# Altium schematic sheet SensWear_PPG.SchDoc
size A4; Size: A4; SheetNumber: 1; SheetTotal: 1
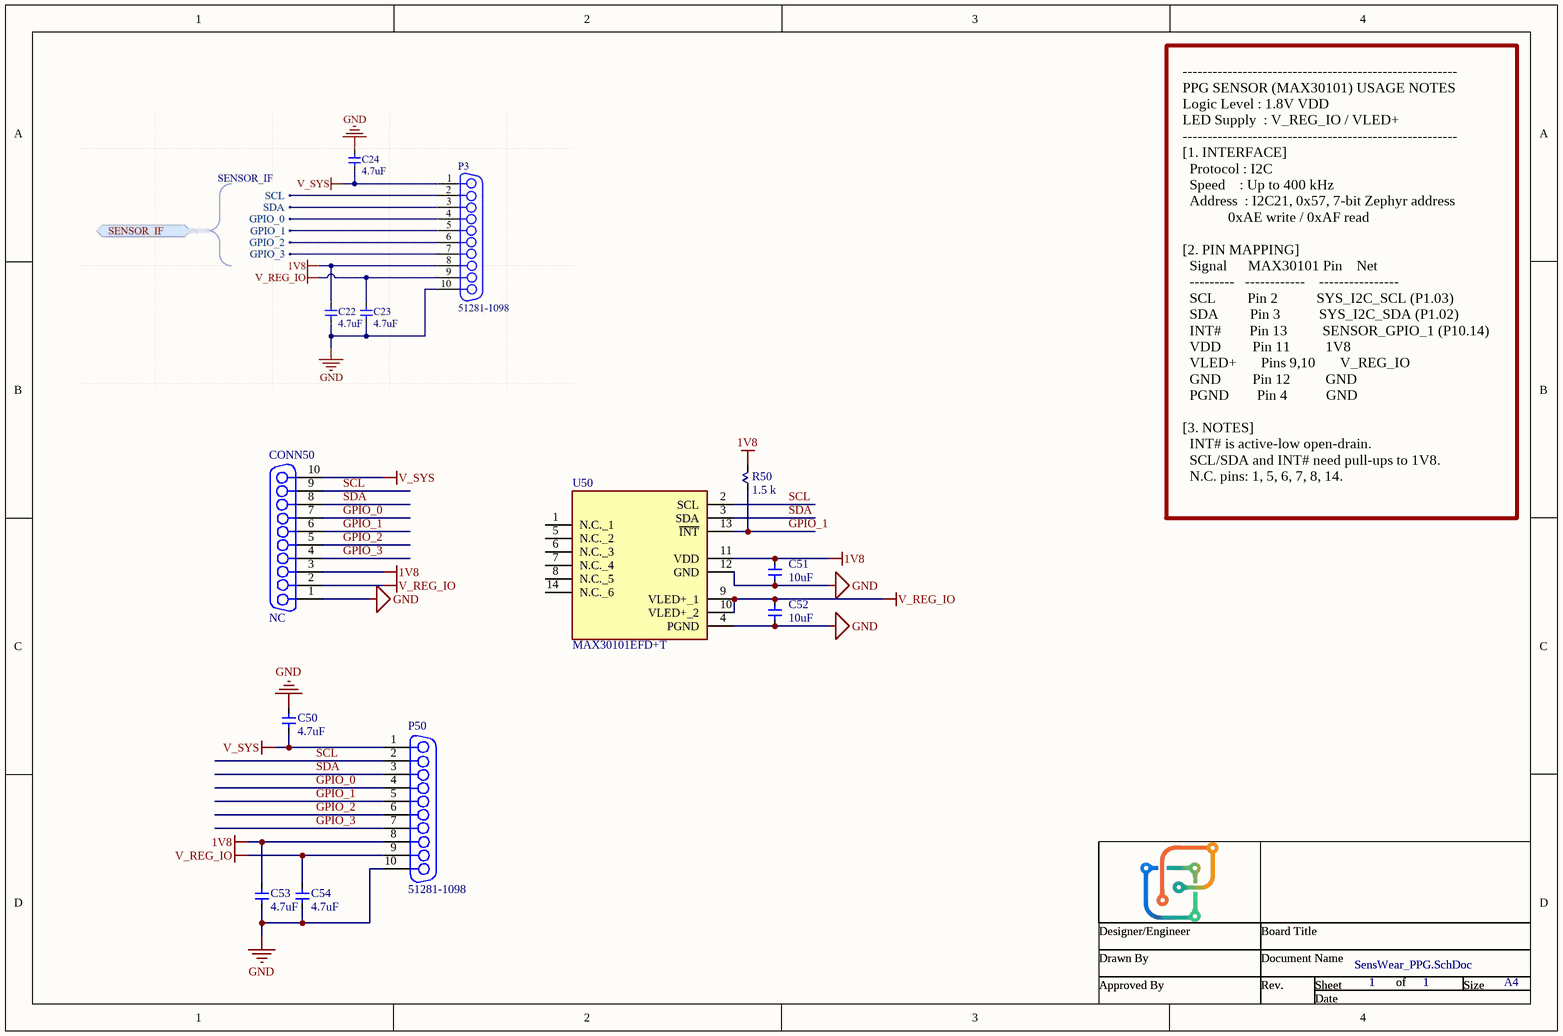
[diagram p0: SensWear_PPG.SchDoc]

## Parts
C50  4.7uF  [CAPC1005X05N]
C51  10uF  [CAPC1005X05N]
C52  10uF  [CAPC1005X05N]
C53  4.7uF  [CAPC1005X05N]
C54  4.7uF  [CAPC1005X05N]
CONN50  NC  [51281-1098-PCB]
P50  51281-1098  [51281-1098__3]
R50  1.5 k  [RESC1005X04N]
U50  MAX30101EFD+T  [14-LEAD-OESIP]

## Nets
1V8: C51.2 C53.2 CONN50.3 P50.8 R50.2 U50.11(VDD)
GND: C50.2 C51.1 C52.2 C53.1 C54.1 CONN50.1 P50.10 U50.4(PGND) U50.12(GND)
V_REG_IO: C52.1 C54.2 CONN50.2 P50.9 U50.9(VLED+_1) U50.10(VLED+_2)
V_SYS: C50.1 CONN50.10 P50.1
GPIO_0: CONN50.7 P50.4
GPIO_1: CONN50.6 P50.5 R50.1 U50.13(~{INT})
GPIO_2: CONN50.5 P50.6
GPIO_3: CONN50.4 P50.7
SCL: CONN50.9 P50.2 U50.2(SCL)
SDA: CONN50.8 P50.3 U50.3(SDA)

Not connected (* = marked no-connect by the designer): U50 1(N.C._1) 5(N.C._2) 6(N.C._3) 7(N.C._4) 8(N.C._5) 14(N.C._6)

## Notes on the sheet
- -------------------------------------------------------
  PPG SENSOR (MAX30101) USAGE NOTES
  Logic Level : 1.8V VDD
  LED Supply  : V_REG_IO / VLED+
  -------------------------------------------------------
  [1. INTERFACE]
  Protocol : I2C
  Speed    : Up to 400 kHz
  Address  : I2C21, 0x57, 7-bit Zephyr address
  0xAE write / 0xAF read
  [2. PIN MAPPING]
  Signal      MAX30101 Pin    Net
  ---------   ------------    ----------------
  SCL         Pin 2           SYS_I2C_SCL (P1.03)
  SDA         Pin 3           SYS_I2C_SDA (P1.02)
  INT#        Pin 13          SENSOR_GPIO_1 (P10.14)
  VDD         Pin 11          1V8
  VLED+       Pins 9,10       V_REG_IO
  GND         Pin 12          GND
  PGND        Pin 4           GND
  [3. NOTES]
  INT# is active-low open-drain.
  SCL/SDA and INT# need pull-ups to 1V8.
  N.C. pins: 1, 5, 6, 7, 8, 14.
- Designer/Engineer
- Drawn By
- Document Name
- Board Title
- Sheet
- of
- Size
- A4
- Approved By
- Rev.
- Date

## Library data of the parts
C50 C53 C54 = GRM155R61A475MEAAD: Multilayer Ceramic Capacitor, 4.7 uF, 10 V, ± 20%, X5R, 0402 [1005 Metric]; Manufacturer: Murata; Material: 4241ConductorMaterial; Voltage Rating: 10V; Dielectric: 1537DielectricType; Manufacturer Part Number: GRM155R61A475MEAAD; RoHS: Yes; Category: Ceramic Capacitors; Stock: 930000; Pricing: 10000=0,0187, 50000=0,0159, 100000=0,0132 (USD); Mounting Technology: Surface Mount; Case/Package: 0402; Case Code (Imperial): 0402; Case Code (Metric): 1005; Min Operating Temperature: -55°C; Max Operating Temperature: 85°C; Packaging: Tape and Reel; Value: 4.7uF; Tolerance: 20%; Series: GRM; Voltage Rating (DC): 10V; Length: 1mm; Width: 500um; Height: 650um; Thickness: 500um; RoHS Compliant: Yes; ComponentLink1URL: http://www.farnell.com/datasheets/2189109.pdf?src-supplier=Farnell; ComponentLink1Description: http://www.farnell.com/datasheets/2189109.pdf?src-supplier=Farnell; ComponentLink2URL: http://www.farnell.com/datasheets/2189109.pdf?src-supplier=Newark; ComponentLink2Description: http://www.farnell.com/datasheets/2189109.pdf?src-supplier=Newark; ComponentLink3URL: http://www.farnell.com/datasheets/2189109.pdf?src-supplier=Element14; ComponentLink3Description: http://www.farnell.com/datasheets/2189109.pdf?src-supplier=Element14; ComponentLink4URL: http://datasheet.octopart.com/GRM155R61A475MEAAD-Murata-datasheet-68589269.pdf?src-supplier=Distrelec; ComponentLink4Description: http://datasheet.octopart.com/GRM155R61A475MEAAD-Murata-datasheet-68589269.pdf?src-supplier=Distrelec; ComponentLink5URL: http://datasheet.octopart.com/GRM155R61A475MEAAD-Murata-datasheet-68589269.pdf?src-supplier=Farnell; ComponentLink5Description: http://datasheet.octopart.com/GRM155R61A475MEAAD-Murata-datasheet-68589269.pdf?src-supplier=Farnell; ComponentLink6URL: https://search.murata.co.jp/Ceramy/image/img/A01X/G101/ENG/GRM155R61A475MEAA-01.pdf?src-supplier=Digi-Key; ComponentLink6Description: https://search.murata.co.jp/Ceramy/image/img/A01X/G101/ENG/GRM155R61A475MEAA-01.pdf?src-supplier=Digi-Key; ComponentLink7URL: http://datasheet.octopart.com/GRM155R61A475MEAAD-Murata-datasheet-68589269.pdf?src-supplier=Future+Electronics; ComponentLink7Description: http://datasheet.octopart.com/GRM155R61A475MEAAD-Murata-datasheet-68589269.pdf?src-supplier=Future+Electronics; ComponentLink8URL: https://datasheet.octopart.com/GRM155R61A475MEAAD-Murata-datasheet-68589269.pdf?src-supplier=Newark; ComponentLink8Description: https://datasheet.octopart.com/GRM155R61A475MEAAD-Murata-datasheet-68589269.pdf?src-supplier=Newark; ComponentLink9URL: http://datasheet.octopart.com/GRM155R61A475MEAAD-Murata-datasheet-68589269.pdf?src-supplier=Verical; ComponentLink9Description: http://datasheet.octopart.com/GRM155R61A475MEAAD-Murata-datasheet-68589269.pdf?src-supplier=Verical; ComponentLink10URL: https://datasheet.octopart.com/GRM155R61A475MEAAD-Murata-datasheet-165579666.pdf?src-supplier=TME; ComponentLink10Description: https://datasheet.octopart.com/GRM155R61A475MEAAD-Murata-datasheet-165579666.pdf?src-supplier=TME; ComponentLink11URL: http://datasheet.octopart.com/GRM155R61A475MEAAD-Murata-datasheet-68589269.pdf?src-supplier=Quest; ComponentLink11Description: http://datasheet.octopart.com/GRM155R61A475MEAAD-Murata-datasheet-68589269.pdf?src-supplier=Quest; ComponentLink12URL: http://datasheet.octopart.com/GRM155R61A475MEAAD-Murata-datasheet-68589269.pdf?src-supplier=TTI; ComponentLink12Description: http://datasheet.octopart.com/GRM155R61A475MEAAD-Murata-datasheet-68589269.pdf?src-supplier=TTI; ComponentLink13URL: http://datasheet.octopart.com/GRM155R61A475MEAAD-Murata-datasheet-68589269.pdf?src-supplier=NAC+Semi; ComponentLink13Description: http://datasheet.octopart.com/GRM155R61A475MEAAD-Murata-datasheet-68589269.pdf?src-supplier=NAC+Semi; Supplier 1: Mouser; Supplier Part Number 1: 81-GRM155R61A475MEAD; Supplier 2: Farnell; Supplier Part Number 2: 3581674
C51 C52 = CL05A106MP5NUNC: Multilayer Ceramic Capacitor, 10 uF, 10 V, ± 20%, X5R, 0402 [1005 Metric]; Manufacturer: Samsung; Voltage Rating: 10V; Supplier: Arrow Electronics; Supplier Part Number: CL05A106MP5NUNC; Manufacturer Part Number: CL05A106MP5NUNC; RoHS: Yes; Category: Ceramic Capacitors; Stock: 275; Pricing: 1=0,1584, 10=0,0737, 25=0,073, 100=0,0424, 250=0,042, 500=0,0416, 1000=0,0375 (USD); Mounting Technology: Surface Mount; Case/Package: 0402; Case Code (Metric): 1005; Case Code (Imperial): 0402; Min Operating Temperature: -55°C; Max Operating Temperature: 85°C; Package Quantity: 1; Packaging: Tape and Reel; Value: 10uF; Tolerance: 20%; Dielectric: X5R; Series: CL; Length: 1mm; Width: 0.02inch; Thickness: 0.028inch; Depth: 0.5mm; Radiation Hardening: No; Lead Free: Lead Free; RoHS Compliant: Yes; ComponentLink1URL: https://datasheet.ciiva.com/25721/cl05a106mp5nunc-25721584.pdf?src-supplier=Digi-Key; ComponentLink1Description: https://datasheet.ciiva.com/25721/cl05a106mp5nunc-25721584.pdf?src-supplier=Digi-Key; ComponentLink2URL: https://datasheet.ciiva.com/26838/getdatasheetpartid-745310-26838170.pdf?src-supplier=Verical; ComponentLink2Description: https://datasheet.ciiva.com/26838/getdatasheetpartid-745310-26838170.pdf?src-supplier=Verical; Supplier 1: Mouser; Supplier Part Number 1: 187-CL05A106MP5NUNC; Supplier 2: Digikey; Supplier Part Number 2: 1276-1450-1-ND
CONN50 = 51281-1098-PCB: System: Connector
P50 = 51281-1098: FFC/FPC Connector, Surface Mount, Right-Angle, Non-ZIF, Dual Contact Style; Manufacturer: Molex; Supplier: Digikey; Supplier Part Number: 900-0512811098CT-ND; Manufacturer Part Number: 51281-1098; RoHS: No; Stock: 2876; Pricing: 1=0.7, 10=0.594, 25=0.5568, 50=0.53, 100=0.5047, 250=0.47304, 500=0.45042, 1000=0.42891 (USD); ComponentLink1URL: https://datasheet.octopart.com/51281-1098-Molex-datasheet-165827616.pdf?src-supplier=Farnell; ComponentLink1Description: https://datasheet.octopart.com/51281-1098-Molex-datasheet-165827616.pdf?src-supplier=Farnell; Supplier 1: Mouser; Supplier Part Number 1: 538-51281-1098; Supplier 2: Digikey; Supplier Part Number 2: 900-0512811098CT-ND; Supplier 3: Digikey; Supplier Part Number 3: 900-0512811098DKR-ND; System: Connector
R50 = ERJ-2RKF1501X: RES SMD 1.5K OHM 1% 1/10W 0402; Manufacturer: Panasonic Electronic Components; Power (Watts): 0.1W, 1/10W; Temperature Coefficient: ±100ppm/°C; Supplier 1: Digi-Key; Manufacturer Part Number: ERJ-2RKF1501X; RoHS: RoHS Compliant; Category: Resistors; Stock 1: 1349197; Pricing 1: 1=0.1, 10=0.025, 25=0.018, 50=0.0136, 100=0.01, 250=0.00764, 500=0.00612, 1000=0.00451, 5000=0.00323 (USD); Packaging: Digi-Reel®; Part Status: Active; Resistance (Ohms): 1.5k; Tolerance: ±1%; Composition: Thick Film; Features: Automotive AEC-Q200; Operating Temperature: -55°C ~ 155°C; Package / Case: 0402 (1005 Metric); Supplier Device Package: 0402; Size / Dimension: 0.039" L x 0.020" W (1.00mm x 0.50mm); Height - Seated (Max): 0.016" (0.40mm); Number of Terminations: 2; Failure Rate: -; ComponentLink1URL: https://industrial.panasonic.com/cdbs/www-data/pdf/RDA0000/AOA0000C283.pdf; ComponentLink1Description: https://industrial.panasonic.com/cdbs/www-data/pdf/RDA0000/AOA0000C283.pdf; Supplier Part Number 1: P1.50KLDKR-ND; Value: 1.5 k
U50 = MAX30101EFD+T: High-Sensitivity Pulse Oximeter and Heart-Rate Sensor for Fitness & Healthcare; Manufacturer: Maxim; Output Type: I2C; Supplier: Digikey; Supplier Part Number: MAX30101EFD+TCT-ND; Manufacturer Part Number: MAX30101EFD+T; RoHS: Yes; Category: Sensors; Stock: 1955; Pricing: 1=11.32, 10=10.228, 25=9.752, 100=8.4676, 250=8.08708, 500=7.3735, 1000=6.42208 (USD); Min Operating Temperature: -40°C; Max Operating Temperature: 85°C; Series: -; Packaging: Cut Tape; RoHS Compliant: Yes; ComponentLink1URL: https://datasheets.maximintegrated.com/en/ds/MAX30101.pdf?src-supplier=Digikey; ComponentLink1Description: https://datasheets.maximintegrated.com/en/ds/MAX30101.pdf?src-supplier=Digikey; Supplier 1: Mouser; Supplier Part Number 1: 700-MAX30101EFD+T; Supplier 2: Digikey; Supplier Part Number 2: MAX30101EFD+TCT-ND; Supplier 3: Digikey; Supplier Part Number 3: MAX30101EFD+TDKR-ND